# EAGLE schematic Z80RT (EAGLE 6.1)
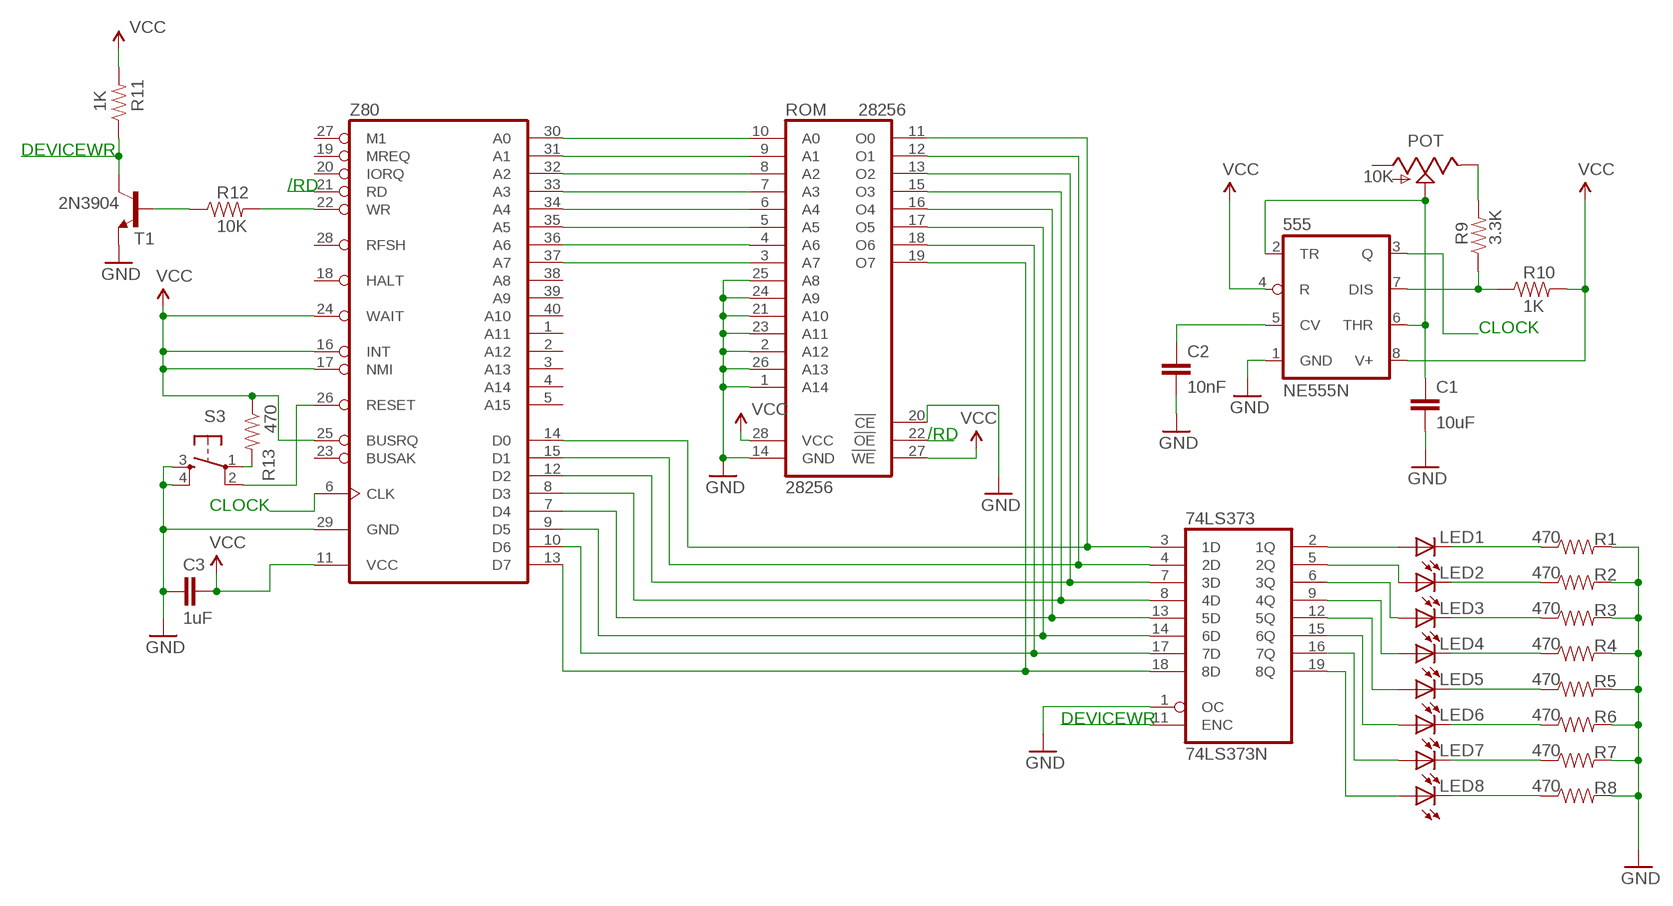
[diagram p0: schematic, sheet 1]

## Parts
74LS373  74LS373N  [DIL20]
555  NE555N  [DIL08-ROUND]
C1  10uF  CAP  [E5-5]
C2  10nF  CAP  [E5-5]
C3  1uF  CAP  [E5-5]
LED1  LED5MM  [LED5MM]
LED2  LED5MM  [LED5MM]
LED3  LED5MM  [LED5MM]
LED4  LED5MM  [LED5MM]
LED5  LED5MM  [LED5MM]
LED6  LED5MM  [LED5MM]
LED7  LED5MM  [LED5MM]
LED8  LED5MM  [LED5MM]
POT  10K  POT-RV16AF-20  [POT_ALPHA_RV16AF-20]
R1  470  RESISTORPTH-1/4W  [AXIAL-0.4]
R2  470  RESISTORPTH-1/4W  [AXIAL-0.4]
R3  470  RESISTORPTH-1/4W  [AXIAL-0.4]
R4  470  RESISTORPTH-1/4W  [AXIAL-0.4]
R5  470  RESISTORPTH-1/4W  [AXIAL-0.4]
R6  470  RESISTORPTH-1/4W  [AXIAL-0.4]
R7  470  RESISTORPTH-1/4W  [AXIAL-0.4]
R8  470  RESISTORPTH-1/4W  [AXIAL-0.4]
R9  3.3K  RESISTORPTH-1/4W  [AXIAL-0.4]
R10  1K  RESISTORPTH-1/4W  [AXIAL-0.4]
R11  1K  RESISTORPTH-1/4W  [AXIAL-0.4]
R12  10K  RESISTORPTH-1/4W  [AXIAL-0.4]
R13  470  RESISTORPTH-1/4W  [AXIAL-0.4]
ROM  28256  [DIL28]
S3  TAC_SWITCHPTH  [TACTILE-PTH]
T1  2N3904  [TO92]
Z80  Z80CPU  [DIL40]

## Nets
/RD: ROM.22(!OE) Z80.21(RD)
CLOCK: 555.3(Q) Z80.6(CLK)
DEVICEWR: 74LS373.11(ENC) R11.P$1 T1.1(C)
GND: 74LS373.1(OC) 555.1(GND) C1.- C2.- C3.- R1.P$2 R2.P$2 R3.P$2 R4.P$2 R5.P$2 R6.P$2 R7.P$2 R8.P$2 ROM.1(A14) ROM.2(A12) ROM.14(GND) ROM.20(!CE) ROM.21(A10) ROM.23(A11) ROM.24(A9) ROM.25(A8) ROM.26(A13) S3.3 S3.4 T1.3(E) Z80.29(GND)
N$1: R12.P$2 Z80.22(WR)
N$5: 74LS373.3(1D) ROM.11(O0) Z80.14(D0)
N$12: 74LS373.4(2D) ROM.12(O1) Z80.15(D1)
N$14: 74LS373.7(3D) ROM.13(O2) Z80.12(D2)
N$15: 74LS373.8(4D) ROM.15(O3) Z80.8(D3)
N$16: 74LS373.13(5D) ROM.16(O4) Z80.7(D4)
N$17: 74LS373.14(6D) ROM.17(O5) Z80.9(D5)
N$18: 74LS373.17(7D) ROM.18(O6) Z80.10(D6)
N$19: 74LS373.18(8D) ROM.19(O7) Z80.13(D7)
N$21: ROM.10(A0) Z80.30(A0)
N$22: ROM.9(A1) Z80.31(A1)
N$23: ROM.8(A2) Z80.32(A2)
N$24: ROM.7(A3) Z80.33(A3)
N$25: ROM.6(A4) Z80.34(A4)
N$26: ROM.5(A5) Z80.35(A5)
N$27: ROM.4(A6) Z80.36(A6)
N$28: ROM.3(A7) Z80.37(A7)
N$29: R12.P$1 T1.2(B)
N$31: LED1.K(C) R1.P$1
N$32: LED2.K(C) R2.P$1
N$33: LED3.K(C) R3.P$1
N$34: LED4.K(C) R4.P$1
N$35: LED5.K(C) R5.P$1
N$36: LED6.K(C) R6.P$1
N$37: LED7.K(C) R7.P$1
N$38: S3.2 Z80.26(RESET)
N$39: R13.P$2 S3.1
N$40: LED8.K(C) R8.P$1
N$41: 555.7(DIS) R9.P$1 R10.P$1
N$42: 555.2(TR) 555.6(THR) C1.+ POT.2(S)
N$43: 555.5(CV) C2.+
N$44: 74LS373.2(1Q) LED1.A
N$45: POT.3(E) R9.P$2
N$46: 74LS373.5(2Q) LED2.A
N$47: 74LS373.6(3Q) LED3.A
N$48: 74LS373.9(4Q) LED4.A
N$49: 74LS373.12(5Q) LED5.A
N$50: 74LS373.15(6Q) LED6.A
N$51: 74LS373.16(7Q) LED7.A
N$52: 74LS373.19(8Q) LED8.A
VCC: 555.4(R) 555.8(V+) C3.+ R10.P$2 R11.P$2 R13.P$1 ROM.27(!WE) ROM.28(VCC) Z80.11(VCC) Z80.16(INT) Z80.17(NMI) Z80.24(WAIT) Z80.25(BUSRQ)
Unconnected: POT.1(A) Z80.1(A11) Z80.2(A12) Z80.3(A13) Z80.4(A14) Z80.5(A15) Z80.18(HALT) Z80.19(MREQ) Z80.20(IORQ) Z80.23(BUSAK) Z80.27(M1) Z80.28(RFSH) Z80.38(A8) Z80.39(A9) Z80.40(A10)

## Notes on the sheet
- DEVICEWR
- /RD
- CLOCK
- /RD
- CLOCK
- DEVICEWR

## Power pins joined to a net without a drawn wire
GND: 74LS373.10(GND)
VCC: 74LS373.20(VCC)

## Library data of the parts
74LS373 = 74xx-us:74*373: Octal D type transparent LATCH, edge triggered
555 = adafruit:*555: TIMER Changed DIP package to have round (not oval) pin pads http://www.ladyada.net/library/pcb/eaglelibrary.html
C1-C3 = MCParts:CAP: Capacitor Standard 0603 ceramic capacitor, and 0.1" leaded capacitor.
LED1-LED8 = adafruit:LED: LED OSRAM: - CHIPLED LG R971, LG N971, LY N971, LG Q971, LY Q971, LO R971, LY R971 LH N974, LH R974 LS Q976, LO Q976, LY Q976 LO Q996 - Hyper CHIPLED LW Q18S LB Q993, LB Q99A, LB R99A - SideLED LS A670, LO A670, LY A670, LG A670, LP A670 LB A673, LV A673, LT A673, LW A673 LH A674 LY A675 LS A676, LA A676, LO A676, LY A676, LW A676 LS A679, LY A679, LG A679 - Hyper Micro SIDELED® LS Y876, LA Y876, LO Y876, LY Y876 LT Y87S - SmartLED LW L88C, LW L88S LB L89C, LB L89S, LG L890 LS L89K, LO L89K, LY L89K LS L896, LA L896, LO L896, LY L896 - TOPLED LS T670, LO T670, LY T670, LG T670, LP T670 LSG T670, LSP T670, LSY T670, LOP T670, LYG T670 LG T671, LOG T671, LSG T671 LB T673, LV T673, LT T673, LW T673 LH T674 LS T676, LA T676, LO T676, LY T676, LB T676, LH T676, LSB T676, LW T676 LB T67C, LV T67C, LT T67C, LS T67K, LO T67K, LY T67K, LW E67C LS E67B, LA E67B, LO E67B, LY E67B, LB E67C, LV E67C, LT E67C LW T67C LS T679, LY T679, LG T679 LS T770, LO T770, LY T770, LG T770, LP T770 LB T773, LV T773, LT T773, LW T773 LH T774 LS E675, LA E675, LY E675, LS T675 LS T776, LA T776, LO T776, LY T776, LB T776 LHGB T686 LT T68C, LB T68C - Hyper Mini TOPLED® LB M676 - Mini TOPLED Santana® LG M470 LS M47K, LO M47K, LY M47K Source: http://www.osram.convergy.de/
POT = SparkFun:POT
R1-R13 = MCParts:RESISTOR: Resistor Basic schematic elements and footprints for 0603, 1206, and PTH resistors.
ROM = MCParts:28256
S3 = MCParts:TAC_SWITCH: Momentary Switch Button commonly used for reset or general input. Spark Fun Electronics SKU : COM-00097
T1 = transistor:2N3904: NPN TRANSISTOR
Z80 = zilog:Z80CPU: Z80 FAMILY DEVICE